# EAGLE schematic LilyPad_LED_v11a (EAGLE 7.5.0)
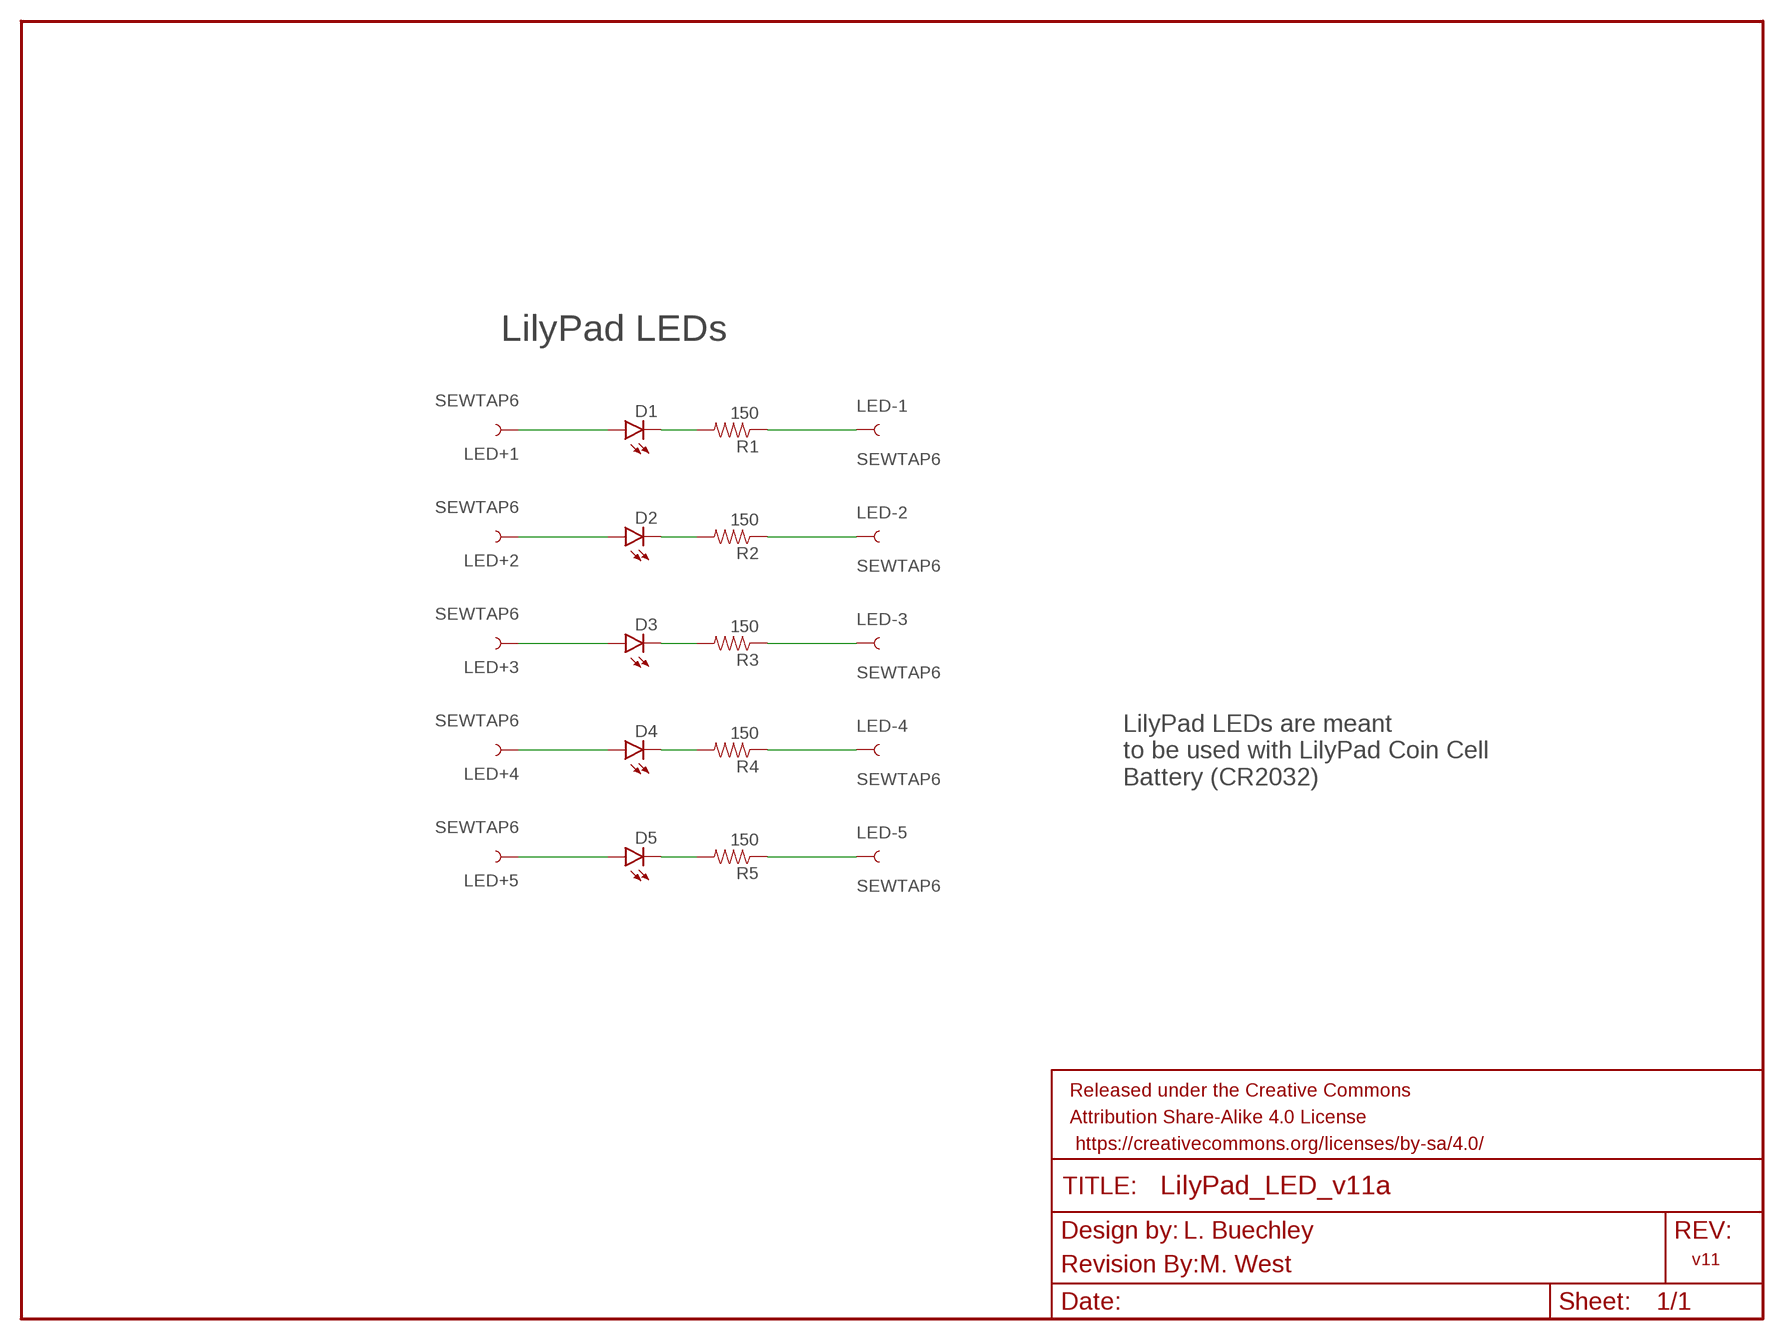
[diagram p0: schematic, sheet 1]

## Parts
D1  LED-WHITE1206  [LED-1206]
D2  LED-WHITE1206  [LED-1206]
D3  LED-WHITE1206  [LED-1206]
D4  LED-WHITE1206  [LED-1206]
D5  LED-WHITE1206  [LED-1206]
FRAME1  FRAME-LETTER  [CREATIVE_COMMONS]
LED+1  SEWTAP6  [PETAL-SMALL-2SIDE]
LED+2  SEWTAP6  [PETAL-SMALL-2SIDE]
LED+3  SEWTAP6  [PETAL-SMALL-2SIDE]
LED+4  SEWTAP6  [PETAL-SMALL-2SIDE]
LED+5  SEWTAP6  [PETAL-SMALL-2SIDE]
LED-1  SEWTAP6  [PETAL-SMALL-2SIDE]
LED-2  SEWTAP6  [PETAL-SMALL-2SIDE]
LED-3  SEWTAP6  [PETAL-SMALL-2SIDE]
LED-4  SEWTAP6  [PETAL-SMALL-2SIDE]
LED-5  SEWTAP6  [PETAL-SMALL-2SIDE]
R1  150  150OHM-1/10W-1%(0603)  [0603-RES]
R2  150  150OHM-1/10W-1%(0603)  [0603-RES]
R3  150  150OHM-1/10W-1%(0603)  [0603-RES]
R4  150  150OHM-1/10W-1%(0603)  [0603-RES]
R5  150  150OHM-1/10W-1%(0603)  [0603-RES]
U$6  REVISION  [REVISION]

## Nets
1: D1.A LED+1.1
2: D1.C R1.2
3: LED-1.1 R1.1
4: D2.A LED+2.1
5: D2.C R2.2
6: LED-2.1 R2.1
7: D3.A LED+3.1
8: D3.C R3.2
9: LED-3.1 R3.1
10: D4.A LED+4.1
11: D4.C R4.2
12: LED-4.1 R4.1
13: D5.A LED+5.1
14: D5.C R5.2
15: LED-5.1 R5.1

## Notes on the sheet
- LilyPad LEDs
- LilyPad LEDs are meant 
  to be used with LilyPad Coin Cell
  Battery (CR2032)
- L. Buechley
- v11
- M. West

## Library data of the parts
D1-D5 = SparkFun-LED:LED-WHITE: White SMD LEDs LilyPad 1206- DIO-09955; PROD_ID: DIO-09955; VALUE: WHITE
FRAME1 = SparkFun-Aesthetics:FRAME-LETTER: Schematic Frame Standard 8.5x11 US Letter frame
LED+1-LED+5 LED-1-LED-5 = LilyPad-Wearables:SEWTAP: Sew Taps for LilyPad Boards.
R1-R5 = SparkFun-Resistors:150OHM-1/10W-1%(0603): RES-11028; PROD-ID: 13326
U$6 = SparkFun-Aesthetics:REVISION